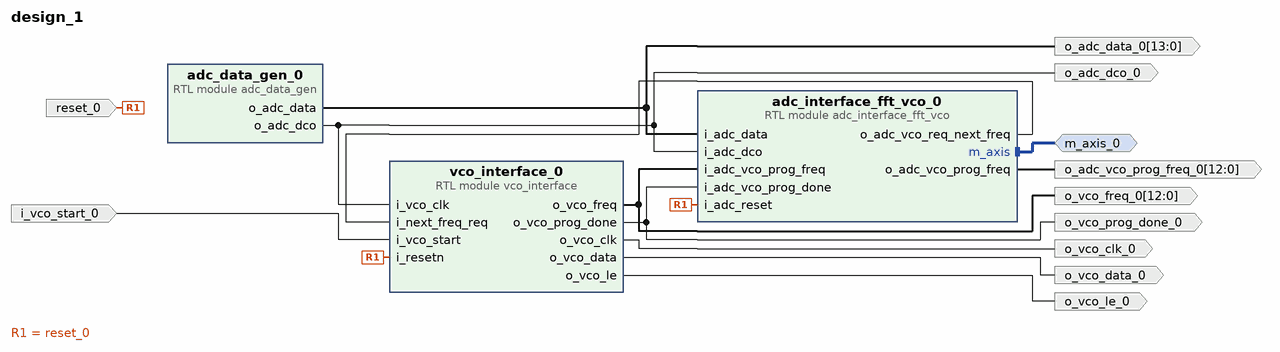
[diagram p0: block diagram of the top level]
# Vivado block design design_1, xc7z020clg484-1, Vivado 2024.2
create_bd_design design_1

create_bd_intf_port -mode Master -vlnv xilinx.com:interface:axis_rtl:1.0 m_axis_0
create_bd_port -dir O o_vco_le_0
create_bd_port -dir O -type clk o_vco_clk_0
create_bd_port -dir O o_vco_data_0
create_bd_port -dir I -type rst reset_0
create_bd_port -dir I i_vco_start_0
create_bd_port -dir O o_vco_prog_done_0
create_bd_port -dir O -from 12 -to 0 o_vco_freq_0
create_bd_port -dir O -from 13 -to 0 o_adc_data_0
create_bd_port -dir O -from 12 -to 0 o_adc_vco_prog_freq_0
create_bd_port -dir O o_adc_dco_0

create_bd_cell -type module -reference adc_data_gen adc_data_gen_0
create_bd_cell -type module -reference vco_interface vco_interface_0
create_bd_cell -type module -reference adc_interface_fft_vco adc_interface_fft_vco_0

# ---- connections ----

connect_bd_intf_net [get_bd_intf_ports m_axis_0] [get_bd_intf_pins adc_interface_fft_vco_0/m_axis]
connect_bd_net [get_bd_pins adc_data_gen_0/o_adc_data] [get_bd_ports o_adc_data_0] [get_bd_pins adc_interface_fft_vco_0/i_adc_data]
connect_bd_net [get_bd_pins adc_data_gen_0/o_adc_dco] \
  [get_bd_ports o_adc_dco_0] [get_bd_pins vco_interface_0/i_vco_clk] [get_bd_pins adc_interface_fft_vco_0/i_adc_dco]
connect_bd_net [get_bd_pins adc_interface_fft_vco_0/o_adc_vco_prog_freq] [get_bd_ports o_adc_vco_prog_freq_0]
connect_bd_net [get_bd_pins adc_interface_fft_vco_0/o_adc_vco_req_next_freq] [get_bd_pins vco_interface_0/i_next_freq_req]
connect_bd_net -net i_vco_start_0_1 [get_bd_ports i_vco_start_0] [get_bd_pins vco_interface_0/i_vco_start]
connect_bd_net -net reset_0_1 [get_bd_ports reset_0] [get_bd_pins vco_interface_0/i_resetn] [get_bd_pins adc_interface_fft_vco_0/i_adc_reset]
connect_bd_net [get_bd_pins vco_interface_0/o_vco_clk] [get_bd_ports o_vco_clk_0]
connect_bd_net [get_bd_pins vco_interface_0/o_vco_data] [get_bd_ports o_vco_data_0]
connect_bd_net [get_bd_pins vco_interface_0/o_vco_freq] [get_bd_ports o_vco_freq_0] [get_bd_pins adc_interface_fft_vco_0/i_adc_vco_prog_freq]
connect_bd_net [get_bd_pins vco_interface_0/o_vco_le] [get_bd_ports o_vco_le_0]
connect_bd_net [get_bd_pins vco_interface_0/o_vco_prog_done] \
  [get_bd_ports o_vco_prog_done_0] [get_bd_pins adc_interface_fft_vco_0/i_adc_vco_prog_done]

validate_bd_design
save_bd_design
